# Altium schematic sheet Audio-Beamformer_V1.0.SchDoc: Audio-Beamformer
size A4; PageSetup: Record=PageOptions|CenterHorizontal=True|CenterVertical=True|PrintScale=0.97|XCorrection=1.00|YCorrection=1.00|PrintKind=0|BorderSize=5000000|LeftOffset=0|BottomOffset=0|Orientation=2|PaperLength=1000|PaperWidth=1000|Scale=100|PaperSource=7|PrintQuality=-3|MediaType=1|DitherType=10|PrintScaleMode=1|PaperKind=A4|PaperIndex=9; Organization: Ostschweizer Fachhochschule; Address2: Florian Baumgartner & Thierry Schwaller; Address3: florian.baumgartner@ost.ch; DocumentNumber: 1; Revision: V1.0; SheetNumber: 1; SheetTotal: 10; Author: Florian Baumgartner & Thierry Schwaller; Subtitle: Overview
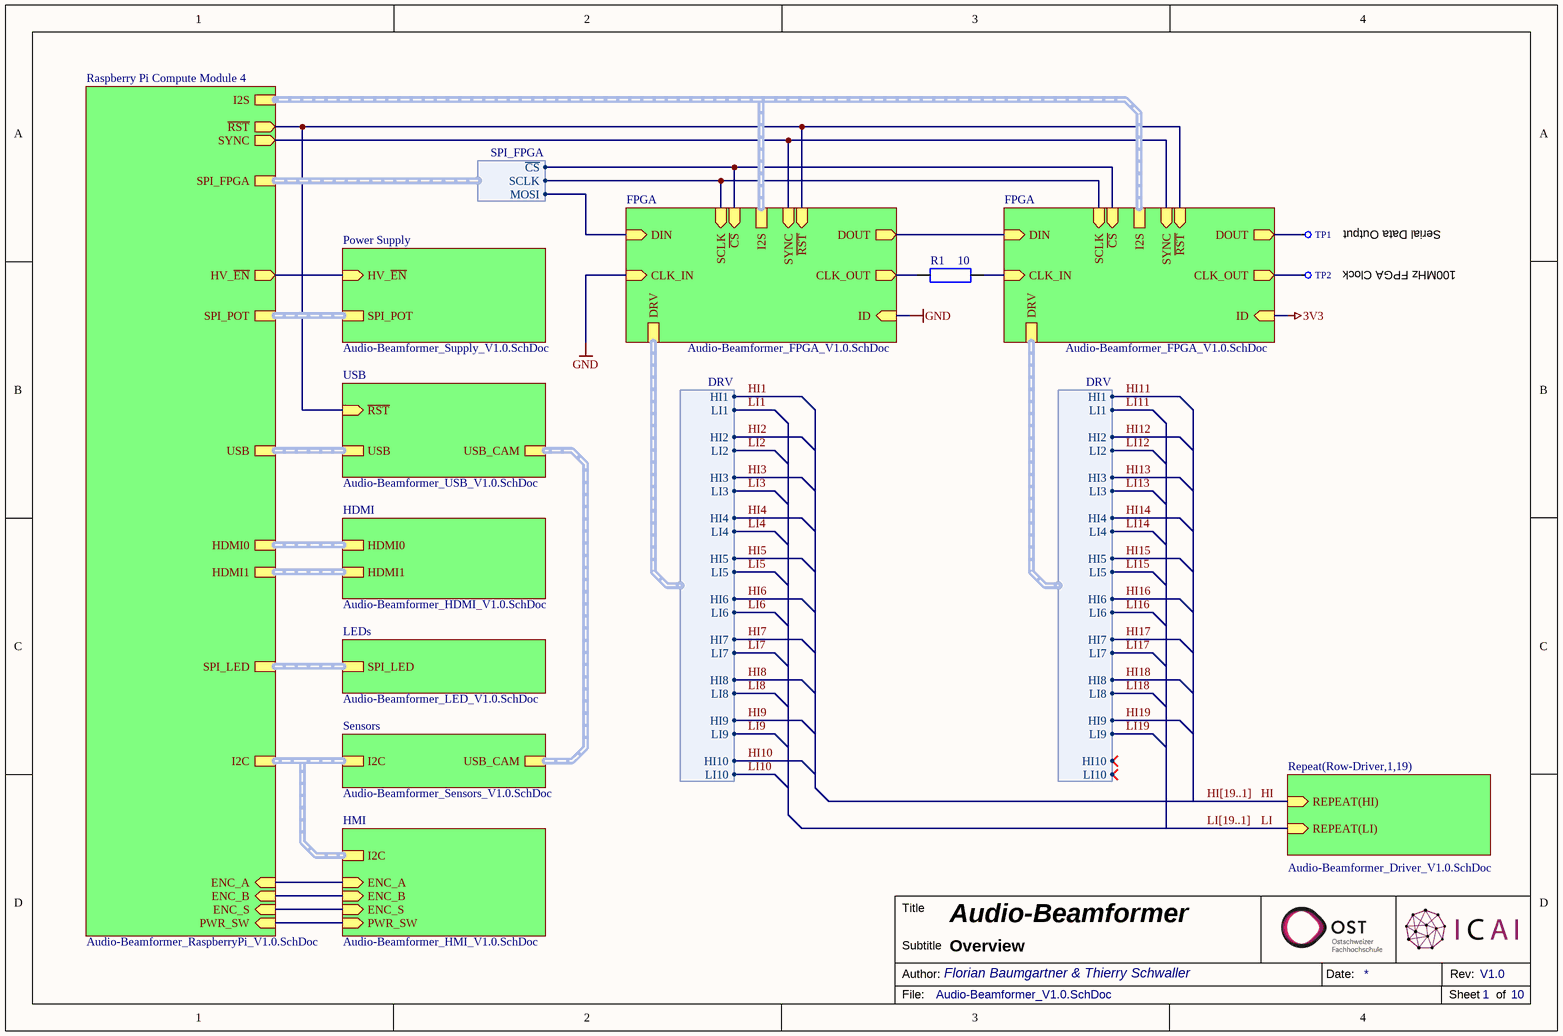
[diagram p0: Audio-Beamformer_V1.0.SchDoc]

## Parts
R1  10  [SMD Widerstand 0603]
TP1  X-TP  [THT Testpunkt Ø1mm]  (value not drawn)  (no BOM)
TP2  X-TP  [THT Testpunkt Ø1mm]  (value not drawn)  (no BOM)

## Sub-sheets
FPGA = Audio-Beamformer_FPGA_V1.0.SchDoc: I2S (harness I2S), CLK_OUT (out), DRV (harness DRV), ~{RST} (in), CLK_IN (in), SYNC (in), ID (in), DOUT (out), SCLK (in), ~{CS} (in), DIN (in)
FPGA = Audio-Beamformer_FPGA_V1.0.SchDoc: I2S (harness I2S), CLK_OUT (out), DRV (harness DRV), ~{RST} (in), CLK_IN (in), SYNC (in), ID (in), DOUT (out), SCLK (in), ~{CS} (in), DIN (in)
HDMI = Audio-Beamformer_HDMI_V1.0.SchDoc: HDMI1 (harness HDMI1), HDMI0 (harness HDMI0)
HMI = Audio-Beamformer_HMI_V1.0.SchDoc: ENC_B (in), ENC_S (in), PWR_SW (in), ENC_A (in), I2C (harness I2C)
LEDs = Audio-Beamformer_LED_V1.0.SchDoc: SPI_LED (harness SPI_LED)
Power Supply = Audio-Beamformer_Supply_V1.0.SchDoc: HV_~{EN} (in), SPI_POT (harness SPI_POT)
Raspberry Pi Compute Module 4 = Audio-Beamformer_RaspberryPi_V1.0.SchDoc: I2C (harness I2C), PWR_SW (in), ~{RST} (out), SPI_POT (harness SPI_POT), HDMI0 (harness HDMI0), HDMI1 (harness HDMI1), SPI_LED (harness SPI_LED), SPI_FPGA (harness SPI_FPGA), I2S (harness I2S), USB (harness USB), ENC_B (in), SYNC (out), ENC_A (in), ENC_S (in), HV_~{EN} (out)
Repeat(Row-Driver,1,19) = Audio-Beamformer_Driver_V1.0.SchDoc: REPEAT(HI) (in), REPEAT(LI) (in)
Sensors = Audio-Beamformer_Sensors_V1.0.SchDoc: I2C (harness I2C), USB_CAM (harness USB_CAM)
USB = Audio-Beamformer_USB_V1.0.SchDoc: USB_CAM (harness USB_CAM), USB (harness USB), ~{RST} (in)

## Harnesses
DRV: LI1, LI2, LI3, LI4, LI5, LI6, LI7, LI8, LI9, LI10, HI1, HI2, HI3, HI4, HI5, HI6, HI7, HI8, HI9, HI10
SPI_FPGA: SCLK, MOSI, ~{CS}

## Nets
3V3: sheet FPGA/ID
GND: sheet FPGA/CLK_IN, sheet FPGA/ID
HI: sheet Repeat(Row-Driver,1,19)/REPEAT(HI)
HI1: sheet FPGA/DRV.HI1
HI2: sheet FPGA/DRV.HI2
HI3: sheet FPGA/DRV.HI3
HI4: sheet FPGA/DRV.HI4
HI5: sheet FPGA/DRV.HI5
HI6: sheet FPGA/DRV.HI6
HI7: sheet FPGA/DRV.HI7
HI8: sheet FPGA/DRV.HI8
HI9: sheet FPGA/DRV.HI9
HI10: sheet FPGA/DRV.HI10
HI11: sheet FPGA/DRV.HI1
HI12: sheet FPGA/DRV.HI2
HI13: sheet FPGA/DRV.HI3
HI14: sheet FPGA/DRV.HI4
HI15: sheet FPGA/DRV.HI5
HI16: sheet FPGA/DRV.HI6
HI17: sheet FPGA/DRV.HI7
HI18: sheet FPGA/DRV.HI8
HI19: sheet FPGA/DRV.HI9
LI: sheet Repeat(Row-Driver,1,19)/REPEAT(LI)
LI1: sheet FPGA/DRV.LI1
LI2: sheet FPGA/DRV.LI2
LI3: sheet FPGA/DRV.LI3
LI4: sheet FPGA/DRV.LI4
LI5: sheet FPGA/DRV.LI5
LI6: sheet FPGA/DRV.LI6
LI7: sheet FPGA/DRV.LI7
LI8: sheet FPGA/DRV.LI8
LI9: sheet FPGA/DRV.LI9
LI10: sheet FPGA/DRV.LI10
LI11: sheet FPGA/DRV.LI1
LI12: sheet FPGA/DRV.LI2
LI13: sheet FPGA/DRV.LI3
LI14: sheet FPGA/DRV.LI4
LI15: sheet FPGA/DRV.LI5
LI16: sheet FPGA/DRV.LI6
LI17: sheet FPGA/DRV.LI7
LI18: sheet FPGA/DRV.LI8
LI19: sheet FPGA/DRV.LI9
NetR1_1: R1.1 ; sheet FPGA/CLK_IN
NetR1_2: R1.2 ; sheet FPGA/CLK_OUT
NetTP1_1: TP1.1 ; sheet FPGA/DOUT
NetTP2_1: TP2.1 ; sheet FPGA/CLK_OUT
(unnamed): sheet Power Supply/HV_~{EN}, sheet Raspberry Pi Compute Module 4/HV_~{EN}
(unnamed): sheet Raspberry Pi Compute Module 4/PWR_SW, sheet HMI/PWR_SW
(unnamed): sheet Raspberry Pi Compute Module 4/~{RST}, sheet USB/~{RST}, sheet FPGA/~{RST}, sheet FPGA/~{RST}
(unnamed): sheet Raspberry Pi Compute Module 4/ENC_B, sheet HMI/ENC_B
(unnamed): sheet Raspberry Pi Compute Module 4/SYNC, sheet FPGA/SYNC, sheet FPGA/SYNC
(unnamed): sheet Raspberry Pi Compute Module 4/ENC_A, sheet HMI/ENC_A
(unnamed): sheet Raspberry Pi Compute Module 4/ENC_S, sheet HMI/ENC_S
(unnamed): sheet FPGA/DOUT, sheet FPGA/DIN
(unnamed): sheet FPGA/SCLK, sheet FPGA/SCLK, sheet Raspberry Pi Compute Module 4/SPI_FPGA.SCLK
(unnamed): sheet FPGA/~{CS}, sheet FPGA/~{CS}, sheet Raspberry Pi Compute Module 4/SPI_FPGA.~{CS}
(unnamed): sheet FPGA/DIN, sheet Raspberry Pi Compute Module 4/SPI_FPGA.MOSI

## Buses and harness runs
bus HI[19..1]
bus LI[19..1]
harness sheet FPGA/I2S = sheet Raspberry Pi Compute Module 4/I2S
harness sheet HDMI/HDMI0 = sheet Raspberry Pi Compute Module 4/HDMI0
harness sheet HDMI/HDMI1 = sheet Raspberry Pi Compute Module 4/HDMI1
harness sheet HMI/I2C = sheet Raspberry Pi Compute Module 4/I2C = sheet Sensors/I2C
harness sheet LEDs/SPI_LED = sheet Raspberry Pi Compute Module 4/SPI_LED
harness sheet Power Supply/SPI_POT = sheet Raspberry Pi Compute Module 4/SPI_POT
harness sheet Raspberry Pi Compute Module 4/USB = sheet USB/USB
harness sheet Sensors/USB_CAM = sheet USB/USB_CAM

## Notes on the sheet
- Serial Data Output
- 100MHz FPGA Clock
- Title
- Author:
- Subtitle
- Date:
- Rev:
- File:
- Sheet
- of

## Library data of the parts
R1 = R-RESISTOR: RES (E=Heizwiderstand B=Messwandler); Component Description: Thick Film Chip Resistor; Component Value: 10 (75V, 100mW, 1%); Digikey: P10.0HCT-ND; Farnell: 2302958; Mouser: 667-ERJ-3EKF10R0V; JLC-Parts: C22859; Unit Price: 0.01
TP1 TP2 = X-TP: Testpunkt; Component Description: Testpoint; Component Value: Ø 0.8mm; Unit Price: 0.00